# Altium schematic sheet GD_Tcontroller_485.SchDoc
size A4
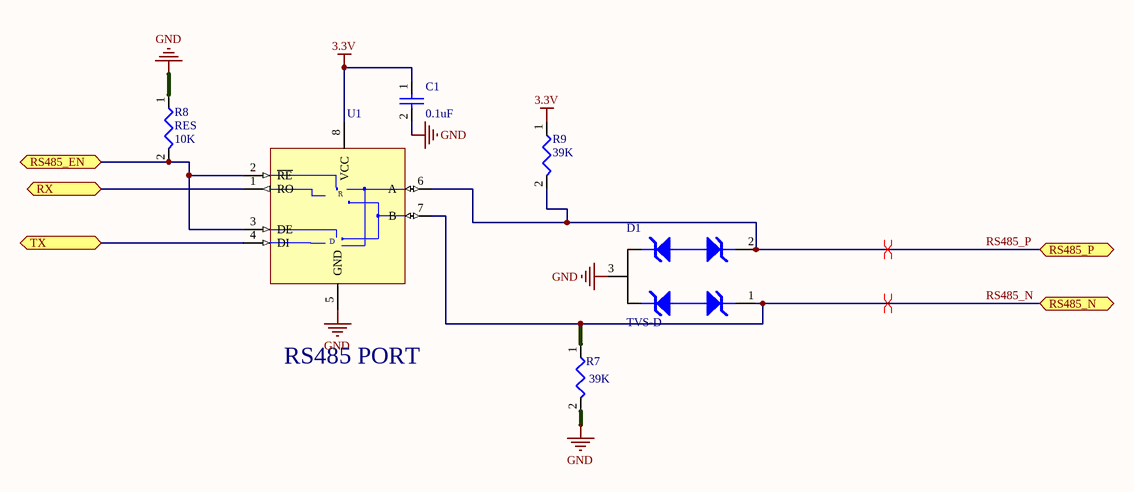
[diagram p0: GD_Tcontroller_485.SchDoc]

## Parts
C1  value 0.1uF  [C0805]  (hidden comment: CAP)
D1  TVS-D  [SOT23-123]
R7  value 39K  [R0805]  (hidden comment: RES)  (no BOM)
R8  RES  value 10K  [R0805]
R9  value 39K  [R0805]  (hidden comment: RES)  (no BOM)
U1  SN65HVD08D  [SOIC8]  (value not drawn)

## Ports
RS485_EN, RS485_N, RS485_P, RX, TX

## Nets
3.3V: C1.1 R9.1 U1.8(VCC)
GND: C1.2 D1.3 R7.2 R8.1 U1.5(GND)
RS485_EN: R8.2 U1.2(~{RE}) U1.3(DE) ; port RS485_EN
RS485_N: D1.1 R7.1 U1.7(B) ; port RS485_N
RS485_P: D1.2 R9.2 U1.6(A) ; port RS485_P
RX: U1.1(RO) ; port RX
TX: U1.4(DI) ; port TX

## Layout directives
differential pair: RS485_N, RS485_P

## Notes on the sheet
- RS485 PORT
- (in symbol EU00041) R; D

## Library data of the parts
C1 = EC00014: CAP SMD CR X7R 50V 10% 0.1uF 0805 ROHS; Manufacturer: YAGEO; Manufacturer P/N: CC0805KRX7R9BB104; ID: 14; HelpURL: *; P/N: EC00014
D1 = ED00007: DIODE TVS 7V 12V 17A 400W SOT-23 SMD ROHS; Manufacturer: BOURNS; ID: 7; Value: CDSOT23-SM712; Type: ****; HelpURL: \\192.168.1.3\Esh\Department\RD\CAD\Component\IO_PROTECTION\BOURNS_CDSOT23-SM712.pdf; P/N: ED00007; Manufacturer P/N: CDSOT23-SM712
R7 R9 = ER00021: RES THICK_FILM SMD 39K 5% 1/8W ROHS 0805; Manufacturer: YAGEO; Manufacturer P/N: RC0805JR-0739KL; ID: 21; HelpURL: *; P/N: ER00021
R8 = ER00213: RES THICK_FILM SMD 10K ohm 5% 1/10W ROHS 0603; Manufacturer: YAGEO; Manufacturer P/N: RC0603JR-1310KL; ID: 213; HelpURL: \\192.168.1.3\Esh\Department\RD\CAD\Component\Resistor\SMD\YAGEO_PYu-RC1206_51_RoHS_L_4.pdf; P/N: ER00213
U1 = EU00041: IC 5V,RS-485,10Mbps,16KV,TRANSCEIVERS,SOIC-8,ROHS; Manufacturer: Texas Instruments; ID: 41; HelpURL: \\192.168.1.3\Esh\Department\RD\CAD\Component\RS485\sn65hvd08.pdf; P/N: EU00041; Manufacturer P/N: SN65HVD08D; Value: SN65HVD08D; Type: *****